# EAGLE design bs_shield (EAGLE 9.1.3)
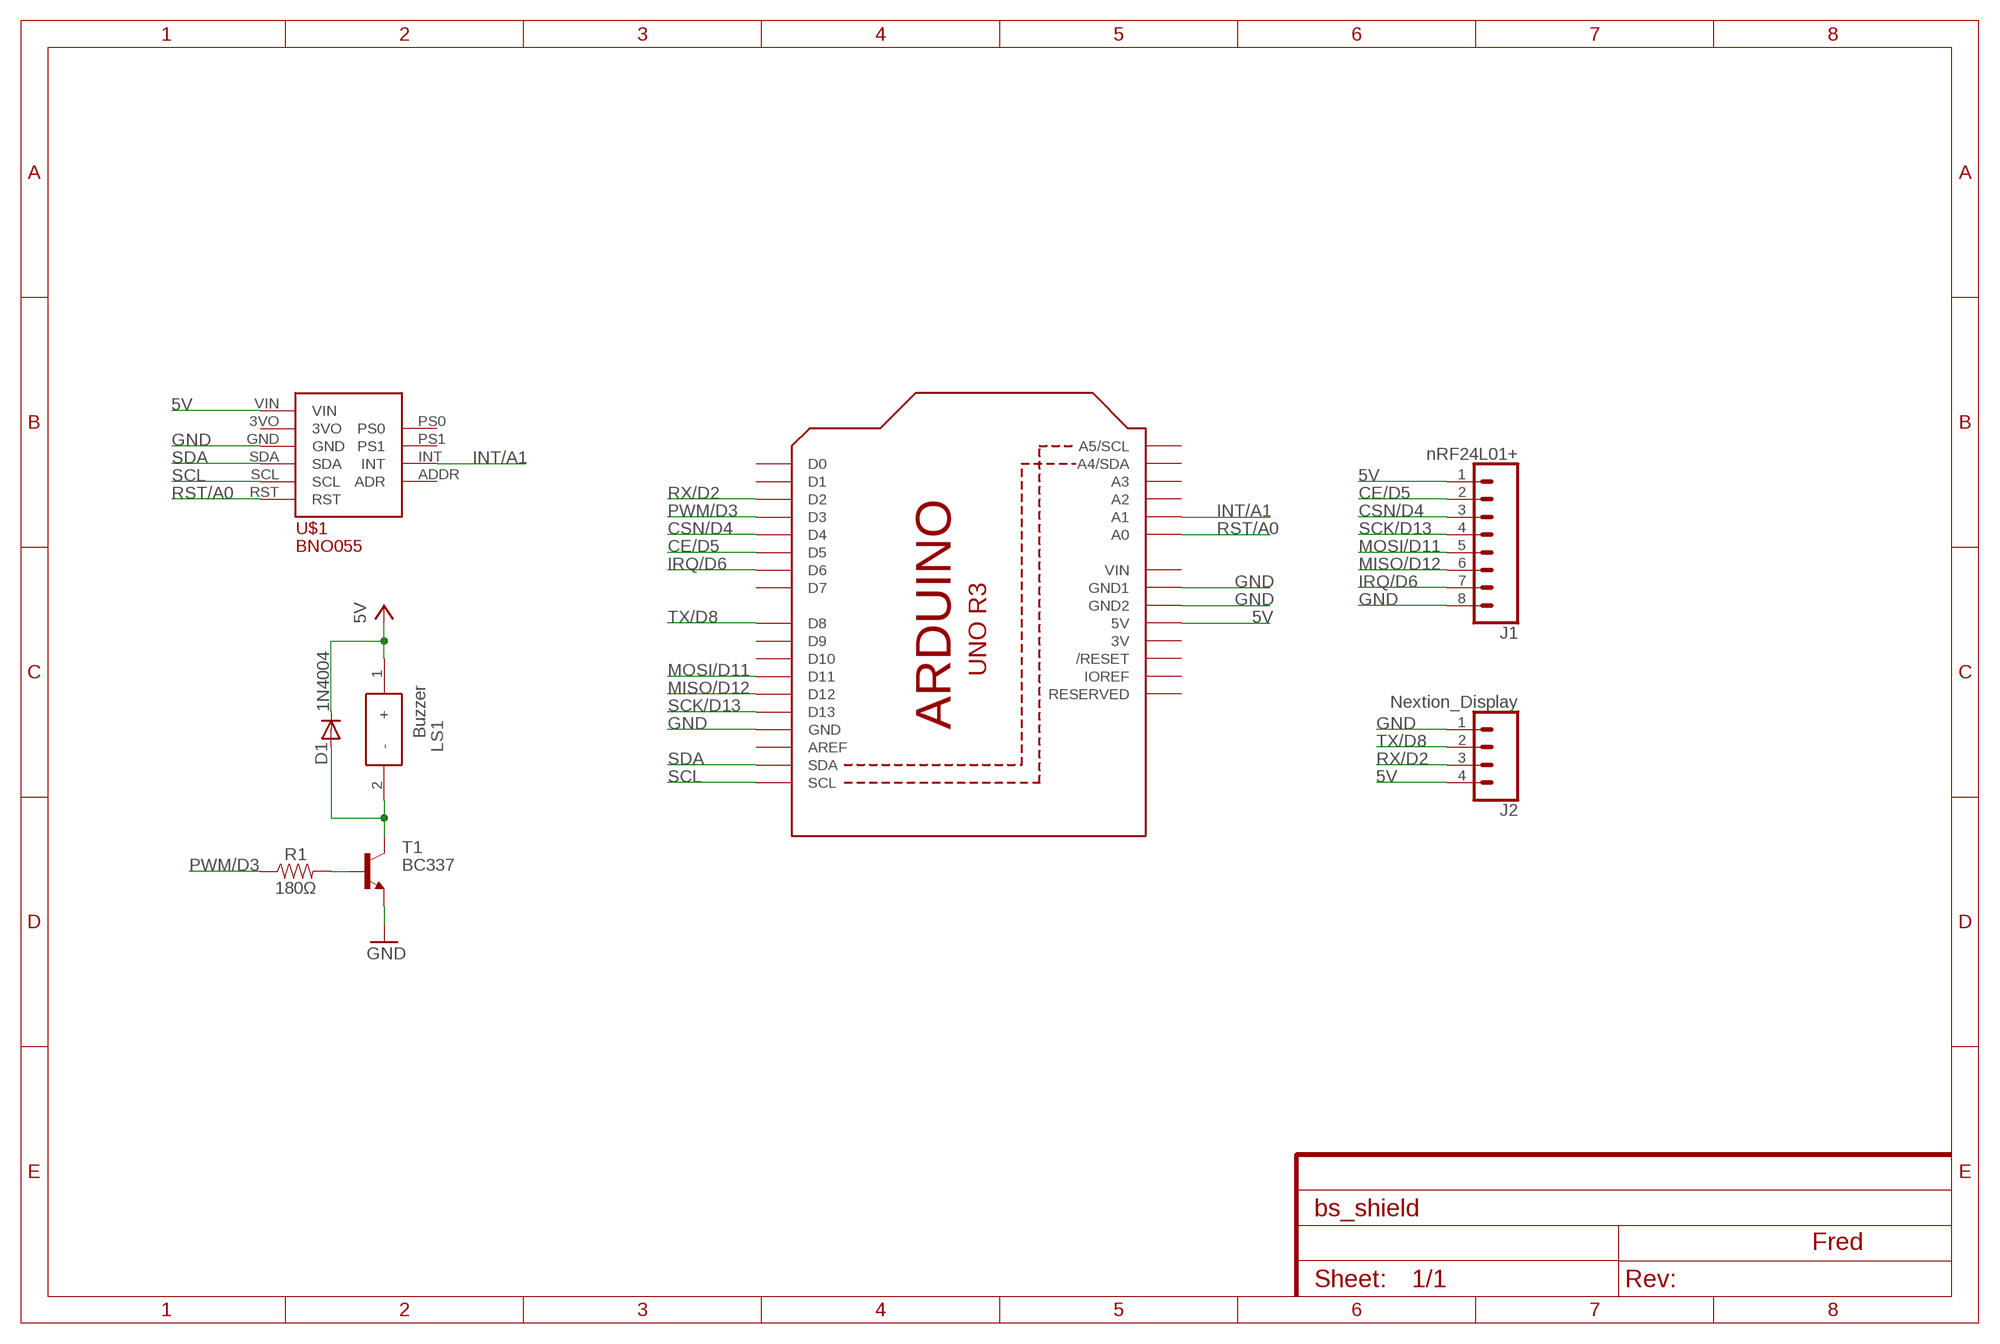
[diagram p0: schematic, sheet 1]

## Parts
D1  1N4004  [DO41-10]
J1  nRF24L01+  CONN_08"  [1X08]
J2  Nextion_Display  CONN_04  [1X04]
LS1  Buzzer  CEM-1203(42)  [CEM-1203(42)]
R1  180Ω  RESISTORAXIAL-0.3  [AXIAL-0.3]
T1  BC337  [TO92]
U1  ARDUINOR3-DIMENSION  [ARDUINOR3]
U$1  BNO055  [BB10]

## Nets
5V: D1.C J1.1 J2.4 LS1.1(+) U1.5V U$1.VIN
CE/D5: J1.2 U1.D5
CSN/D4: J1.3 U1.D4
GND: J1.8 J2.1 T1.1(E) U1.GND U1.GND1 U1.GND2 U$1.GND
INT/A1: U1.A1 U$1.INT
IRQ/D6: J1.7 U1.D6
MISO/D12: J1.6 U1.D12
MOSI/D11: J1.5 U1.D11
N$2: R1.P$2 T1.2(B)
N$3: D1.A LS1.2(-) T1.3(C)
PWM/D3: R1.P$1 U1.D3
RST/A0: U1.A0 U$1.RST
RX/D2: J2.3 U1.D2
SCK/D13: J1.4 U1.D13
SCL: U1.SCL U$1.SCL
SDA: U1.SDA U$1.SDA
TX/D8: J2.2 U1.D8
Unconnected: U1.A2 U1.A3 U1.A4(A4/SDA) U1.A5(A5/SCL) U1.AREF U1.D0 U1.D1 U1.D7 U1.D9 U1.D10 U1.IOREF U1.RESERVED U1.RESET(/RESET) U$1.3VO U$1.ADDR(ADR) U$1.PS0 U$1.PS1

## Notes on the sheet
- Fred

## Power pins joined to a net without a drawn wire
3V: U1.3V
VIN: U1.VIN

## Library data of the parts
D1 = adafruit:1N4004: DIODE General purpose 1N400x type rectifier (With bigger pads) http://www.ladyada.net/library/pcb/eaglelibrary.html
J1 = SparkFun-Connectors:CONN_08: Multi connection point. Often used as Generic Header-pin footprint for 0.1 inch spaced/style header connections On any of the 0.1 inch spaced packages, you can populate with these: Break Away Headers - Straight <https://www.sparkfun.com/products/116> (PRT-00116) Break Away Male Headers - Right Angle <https://www.sparkfun.com/products/553> (PRT-00553) Female Headers <https://www.sparkfun.com/products/115> (PRT-00115) Break Away Headers - Machine Pin <https://www.sparkfun.com/products/117> (PRT-00117) Break Away Female Headers - Swiss Machine Pin <https://www.sparkfun.com/products/743> (PRT-00743) Arduino Stackable Header - 8 Pin <https://www.sparkfun.com/products/9279> (PRT-09279) For SCREWTERMINALS and SPRING TERMINALS visit here: Screw Terimnals on SparkFun.com <https://www.sparkfun.com/search/results?term=Screw+Terminals> (5mm/3.5mm/2.54mm spacing) This device is also useful as a general connection point to wire up your design to another part of your project. Our various solder wires solder well into these plated through hole pads. Hook-Up Wire - Assortment (Stranded, 22 AWG) <https://www.sparkfun.com/products/11375> (PRT-11375) Hook-Up Wire - Assortment (Solid Core, 22 AWG) <https://www.sparkfun.com/products/11367> (PRT-11367) View the entire wire category on our website here <https://www.sparkfun.com/categories/141> Special notes: Molex polarized connector foot print use with SKU : PRT-08231 with associated crimp pins and housings. 1MM SMD Version SKU: PRT-10208 NOTES ON THE VARIANTS LOCK and LOCK_LONGPADS... This footprint was designed to help hold the alignment of a through-hole component (i.e. 6-pin header) while soldering it into place. You may notice that each hole has been shifted either up or down by 0.005 of an inch from it's more standard position (which is a perfectly straight line). This slight alteration caused the pins (the squares in the middle) to touch the edges of the holes. Because they are alternating, it causes a "brace" to hold the component in place. 0.005 has proven to be the perfect amount of "off-center" position when using our standard breakaway headers. Although looks a little odd when you look at the bare footprint, once you have a header in there, the alteration is very hard to notice. Also,if you push a header all the way into place, it is covered up entirely on the bottom side.; PROD_ID: CONN-08438
J2 = SparkFun-Connectors:CONN_04: Multi connection point. Often used as Generic Header-pin footprint for 0.1 inch spaced/style header connections On any of the 0.1 inch spaced packages, you can populate with these: Break Away Headers - Straight <https://www.sparkfun.com/products/116> (PRT-00116) Break Away Male Headers - Right Angle <https://www.sparkfun.com/products/553> (PRT-00553) Female Headers <https://www.sparkfun.com/products/115> (PRT-00115) Break Away Headers - Machine Pin <https://www.sparkfun.com/products/117> (PRT-00117) Break Away Female Headers - Swiss Machine Pin <https://www.sparkfun.com/products/743> (PRT-00743) For SCREWTERMINALS and SPRING TERMINALS visit here: Screw Terimnals on SparkFun.com <https://www.sparkfun.com/search/results?term=Screw+Terminals> (5mm/3.5mm/2.54mm spacing) This device is also useful as a general connection point to wire up your design to another part of your project. Our various solder wires solder well into these plated through hole pads. Hook-Up Wire - Assortment (Stranded, 22 AWG) <https://www.sparkfun.com/products/11375> (PRT-11375) Hook-Up Wire - Assortment (Solid Core, 22 AWG) <https://www.sparkfun.com/products/11367> (PRT-11367) View the entire wire category on our website here <https://www.sparkfun.com/categories/141> Special notes: Molex polarized connector foot print use with SKU : PRT-08231 with associated crimp pins and housings. 1MM SMD Version SKU: PRT-10208; PROD_ID: CONN-09696
LS1 = SamacSys_Parts:CEM-1203(42): Speakers & Transducers Buzzers Source: Datasheet <http://www.mouser.com/datasheet/2/670/cem-1203-42--1309131.pdf>; DESCRIPTION: Speakers & Transducers Buzzers; HEIGHT: mm; MANUFACTURER_NAME: CUI; MANUFACTURER_PART_NUMBER: CEM-1203(42); MOUSER_PART_NUMBER: 490-CEM-1203(42)
R1 = SparkFun-Resistors:RESISTOR: Generic Resistor Package
T1 = transistor:BC337: NPN TRANSISTOR
U1 = adafruit:ARDUINOR3: This is a new object for the new Arduino R3 - with extra pins that you may want to use (such as IOref, and duplicated A4/A5
U$1 = Adafruit_BNO055:BNO055

## Board
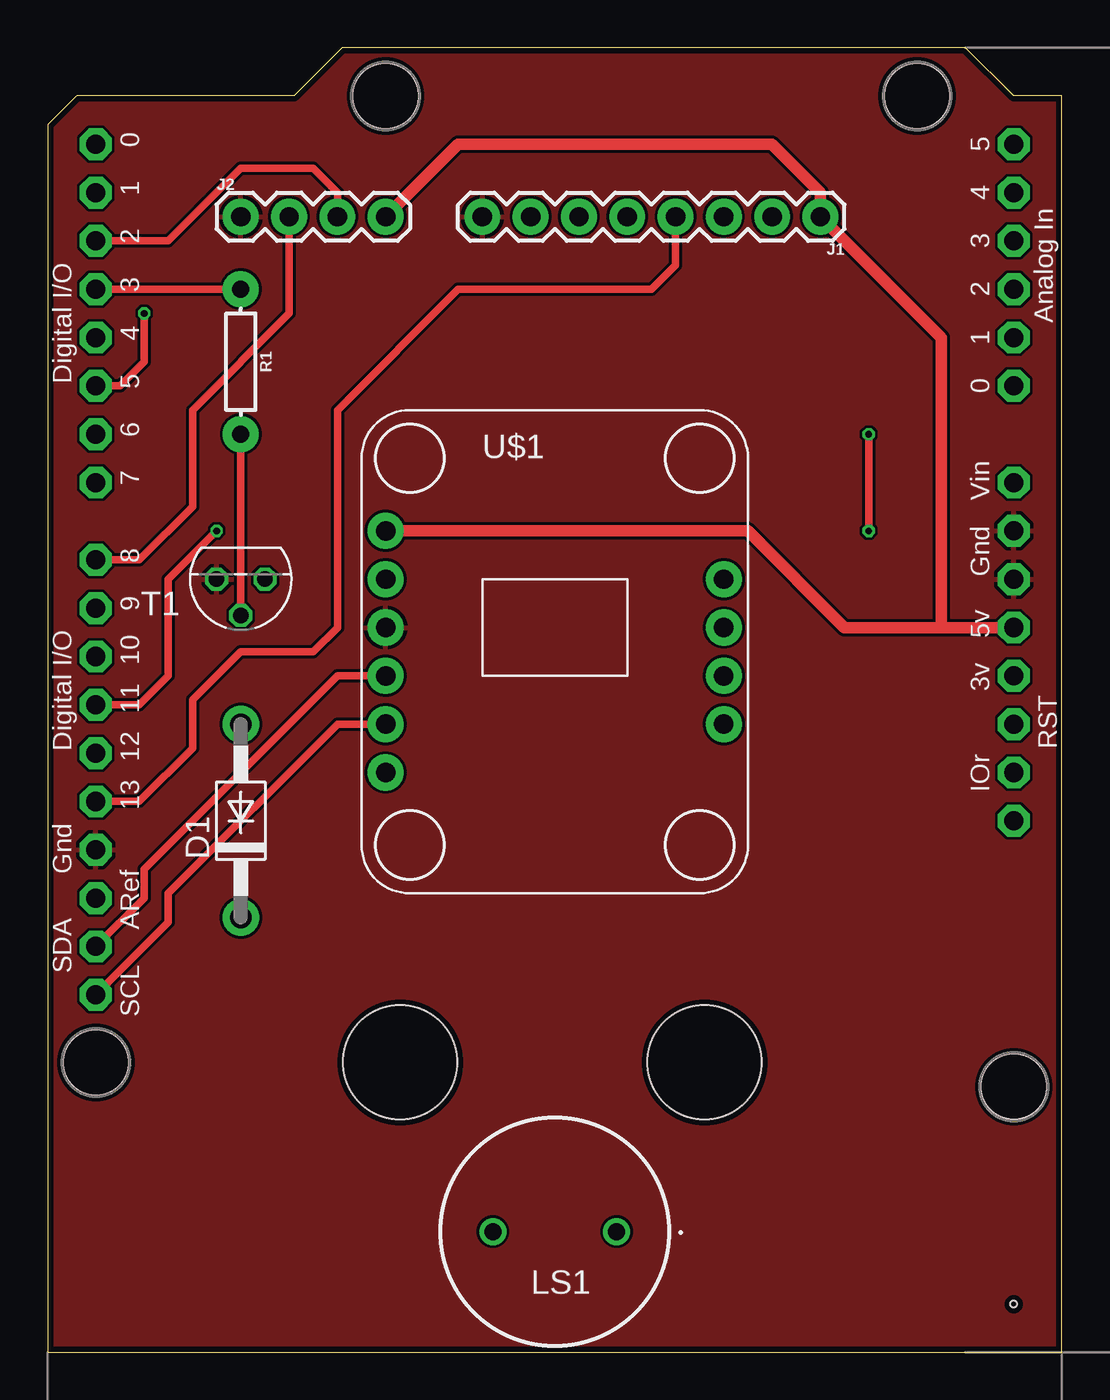
[diagram p1: board, top side]
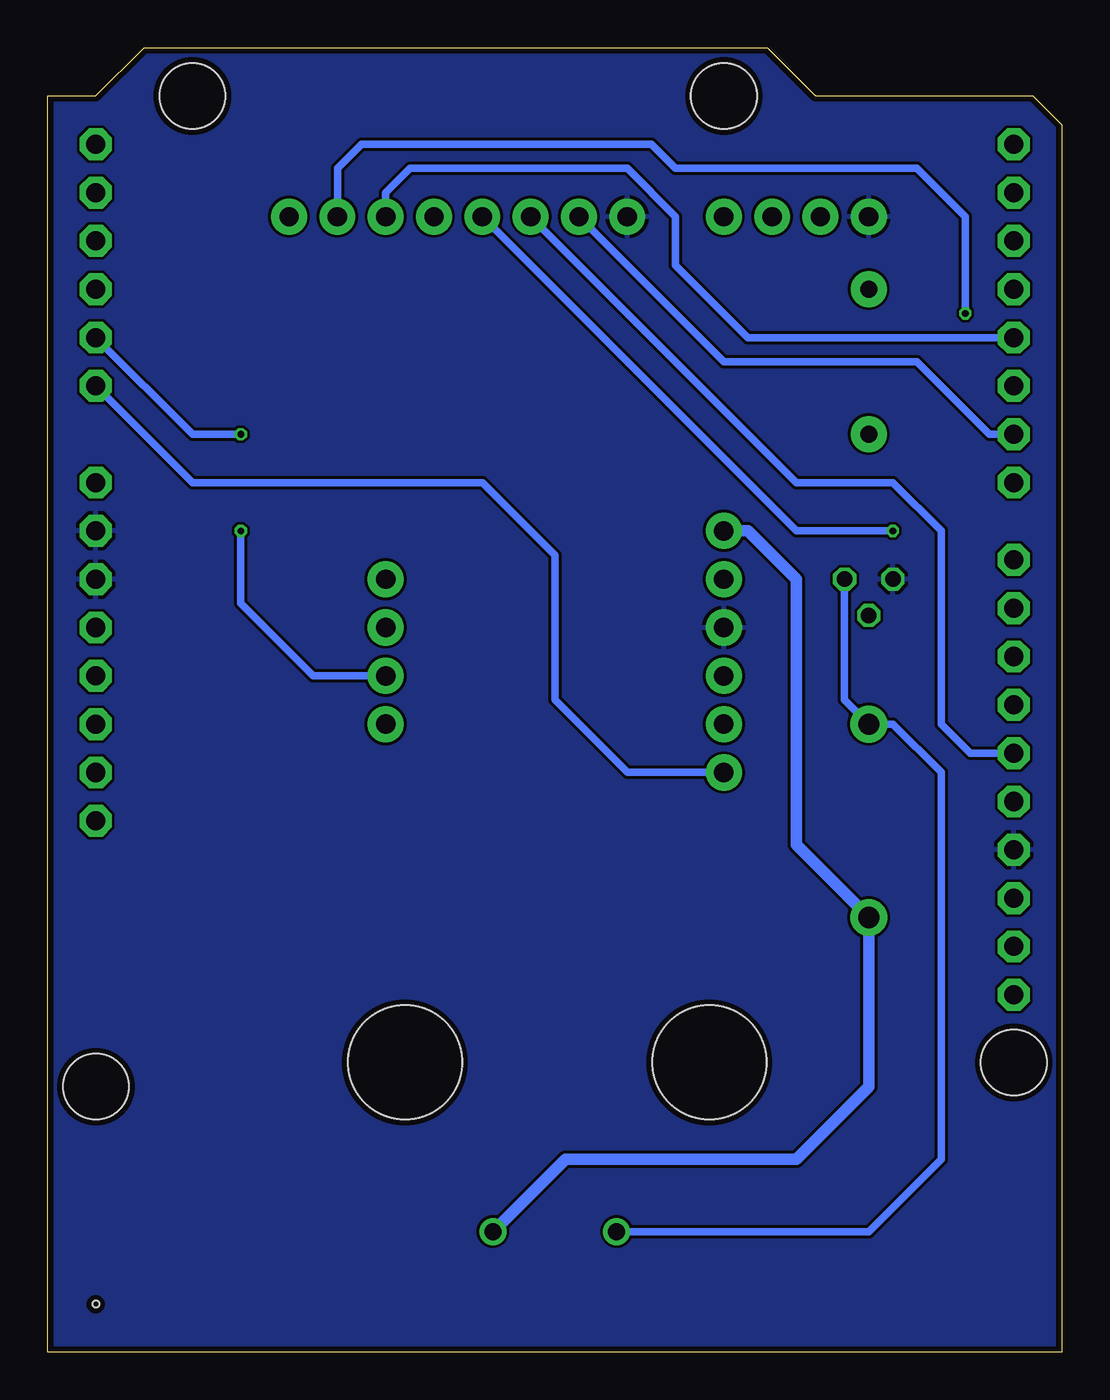
[diagram p2: board, bottom side, seen from below]

Size 53.34 x 68.58 mm. Coordinates in mm from the lower left corner, seen from the top.
Copper layers (1*16): Top 0.035mm / dielectric 1.5mm / Bottom 0.035mm
Design rules "PCB-POOL Standard": minimum track width 0.15mm, minimum drill 0.3mm, track to track 0.15mm, track to pad 0.15mm, pad to pad 0.15mm, via to via 0.15mm, smd to smd 0.15mm, copper to edge 0.3mm, drill to drill 0.2mm, minimum pad ring 0.2mm, minimum via ring 0.15mm, stop-mask expansion 0.075mm, vias tented up to drill 0mil, thermal gap 0.2mm
Holes 0.35 mm at 50.8,2.54
Holes 6 mm at 18.54,15.24 34.54,15.24
Holes 3.46 mm at 2.54,15.24 50.8,13.97 45.72,66.04 17.78,66.04

### Footprints (pad centres in the part's own frame; a part is rotated, then mirrored left to right if it is on the bottom)
DO41-10 = drill 1.118 pad 1.93: A 5.08,0; C -5.08,0
1X08 = drill 1.016 pad 1.88: 1 0,0; 2 2.54,0; 3 5.08,0; 4 7.62,0; 5 10.16,0; 6 12.7,0; 7 15.24,0; 8 17.78,0
1X04 = drill 1.016 pad 1.88: 1 0,0; 2 2.54,0; 3 5.08,0; 4 7.62,0
CEM-1203(42) = drill 0.9 pad 1.41: 1 -3.25,0; 2 3.25,0
AXIAL-0.3 = drill 0.9 pad 1.88: P$1 -3.81,0; P$2 3.81,0
TO92 = drill 0.813 octagon: 1 1.27,0; 2 0,1.905; 3 -1.27,0
ARDUINOR3 = drill 1 pad 1.676 octagon: 3V 35.56,2.54; 5V 38.1,2.54; A0 50.8,2.54; A1 53.34,2.54; A2 55.88,2.54; A3 58.42,2.54; A4 60.96,2.54; A5 63.5,2.54; AREF 23.876,50.8; D0 63.5,50.8; D1 60.96,50.8; D2 58.42,50.8; D3 55.88,50.8; D4 53.34,50.8; D5 50.8,50.8; D6 48.26,50.8; D7 45.72,50.8; D8 41.656,50.8; D9 39.116,50.8; D10 36.576,50.8; D11 34.036,50.8; D12 31.496,50.8; D13 28.956,50.8; GND 26.416,50.8; GND1 43.18,2.54; GND2 40.64,2.54; IOREF 30.48,2.54; RESERVED 27.94,2.54; RESET 33.02,2.54; SCL 18.796,50.8; SDA 21.336,50.8; VIN 45.72,2.54
BB10 = drill 1.016 pad 1.905: 3VO -5.08,2.54; ADDR 12.7,-5.08; GND -5.08,0; INT 12.7,-2.54; PS0 12.7,2.54; PS1 12.7,0; RST -5.08,-7.62; SCL -5.08,-5.08; SDA -5.08,-2.54; VIN -5.08,5.08

### Placement (x,y rotation side)
D1  10.16,27.94 90 top
J1  40.64,59.69 180 top
J2  10.16,59.69 0 top
LS1  26.67,6.35 180 top
R1  10.16,52.07 270 top
T1  10.16,40.64 180 top
U1  53.34,0 90 top
U$1  22.86,38.1 0 top

### Tracks (layer width: path | path; a pad name or v marks a point on that pad's centre or on a via)
5V
  Top 0.61: J2.4 21.59,63.5 38.1,63.5 40.64,60.96 J1.1 46.99,53.34 46.99,38.1 | U$1.VIN 36.83,43.18 41.91,38.1 46.99,38.1 | 46.99,38.1 U1.5V
  Bottom 0.61: U$1.VIN 16.51,43.18 13.97,40.64 13.97,26.67 D1.C 10.16,13.97 13.97,10.16 26.11,10.16 LS1.1
CE/D5  (via drill 0.35)
  Top 0.406: U1.D5 3.81,50.8 5.08,52.07 v5.08,54.61
  Bottom 0.406: v5.08,54.61 5.08,59.69 7.62,62.23 20.32,62.23 21.59,63.5 36.83,63.5 38.1,62.23 J1.2
CSN/D4
  Bottom 0.406: U1.D4 16.51,53.34 20.32,57.15 20.32,59.69 22.86,62.23 34.29,62.23 35.56,60.96 J1.3
GND
  pour Top: 0,0 0,64.77 1.27,66.04 12.7,66.04 15.24,68.58 48.26,68.58 50.8,66.04 53.34,66.04 53.34,0
  pour Bottom: 53.34,0 0,0 0,64.77 1.27,66.04 12.7,66.04 15.24,68.58 48.26,68.58 50.8,66.04 53.34,66.04
INT/A1  (via drill 0.35)
  Top 0.406: v43.18,48.26 v43.18,43.18
  Bottom 0.406: U1.A1 45.72,48.26 v43.18,48.26 | v43.18,43.18 43.18,39.37 39.37,35.56 U$1.INT
IRQ/D6
  Bottom 0.406: J1.7 17.78,52.07 7.62,52.07 3.81,48.26 U1.D6
MISO/D12
  Bottom 0.406: J1.6 13.97,45.72 8.89,45.72 6.35,43.18 6.35,33.02 4.83,31.5 U1.D12
MOSI/D11  (via drill 0.35)
  Top 0.406: v8.89,43.18 6.35,40.64 6.35,35.56 4.83,34.04 U1.D11
  Bottom 0.406: J1.5 13.97,43.18 v8.89,43.18
N$2
  Top 0.406: T1.2 R1.P$2
N$3
  Bottom 0.406: LS1.2 10.16,6.35 6.35,10.16 6.35,30.48 8.89,33.02 D1.A 11.43,34.29 T1.3
PWM/D3
  Top 0.406: R1.P$1 U1.D3
RST/A0
  Bottom 0.406: U1.A0 45.72,45.72 30.48,45.72 26.67,41.91 26.67,34.29 22.86,30.48 U$1.RST
RX/D2
  Top 0.406: U1.D2 6.35,58.42 10.16,62.23 13.97,62.23 15.24,60.96 J2.3
SCK/D13
  Top 0.406: U1.D13 4.83,28.96 7.62,31.75 7.62,34.29 10.16,36.83 13.97,36.83 15.24,38.1 15.24,49.53 21.59,55.88 31.75,55.88 33.02,57.15 J1.4
SCL
  Top 0.406: U1.SCL 6.35,22.61 6.35,24.13 15.24,33.02 U$1.SCL
SDA
  Top 0.406: U1.SDA 5.08,23.88 5.08,25.4 15.24,35.56 U$1.SDA
TX/D8
  Top 0.406: J2.2 12.7,54.61 7.62,49.53 7.62,44.45 4.83,41.66 U1.D8

### Text on the board
tDocu: All dinmensions are in mm